# Altium project MIXR UI.PrjPcb
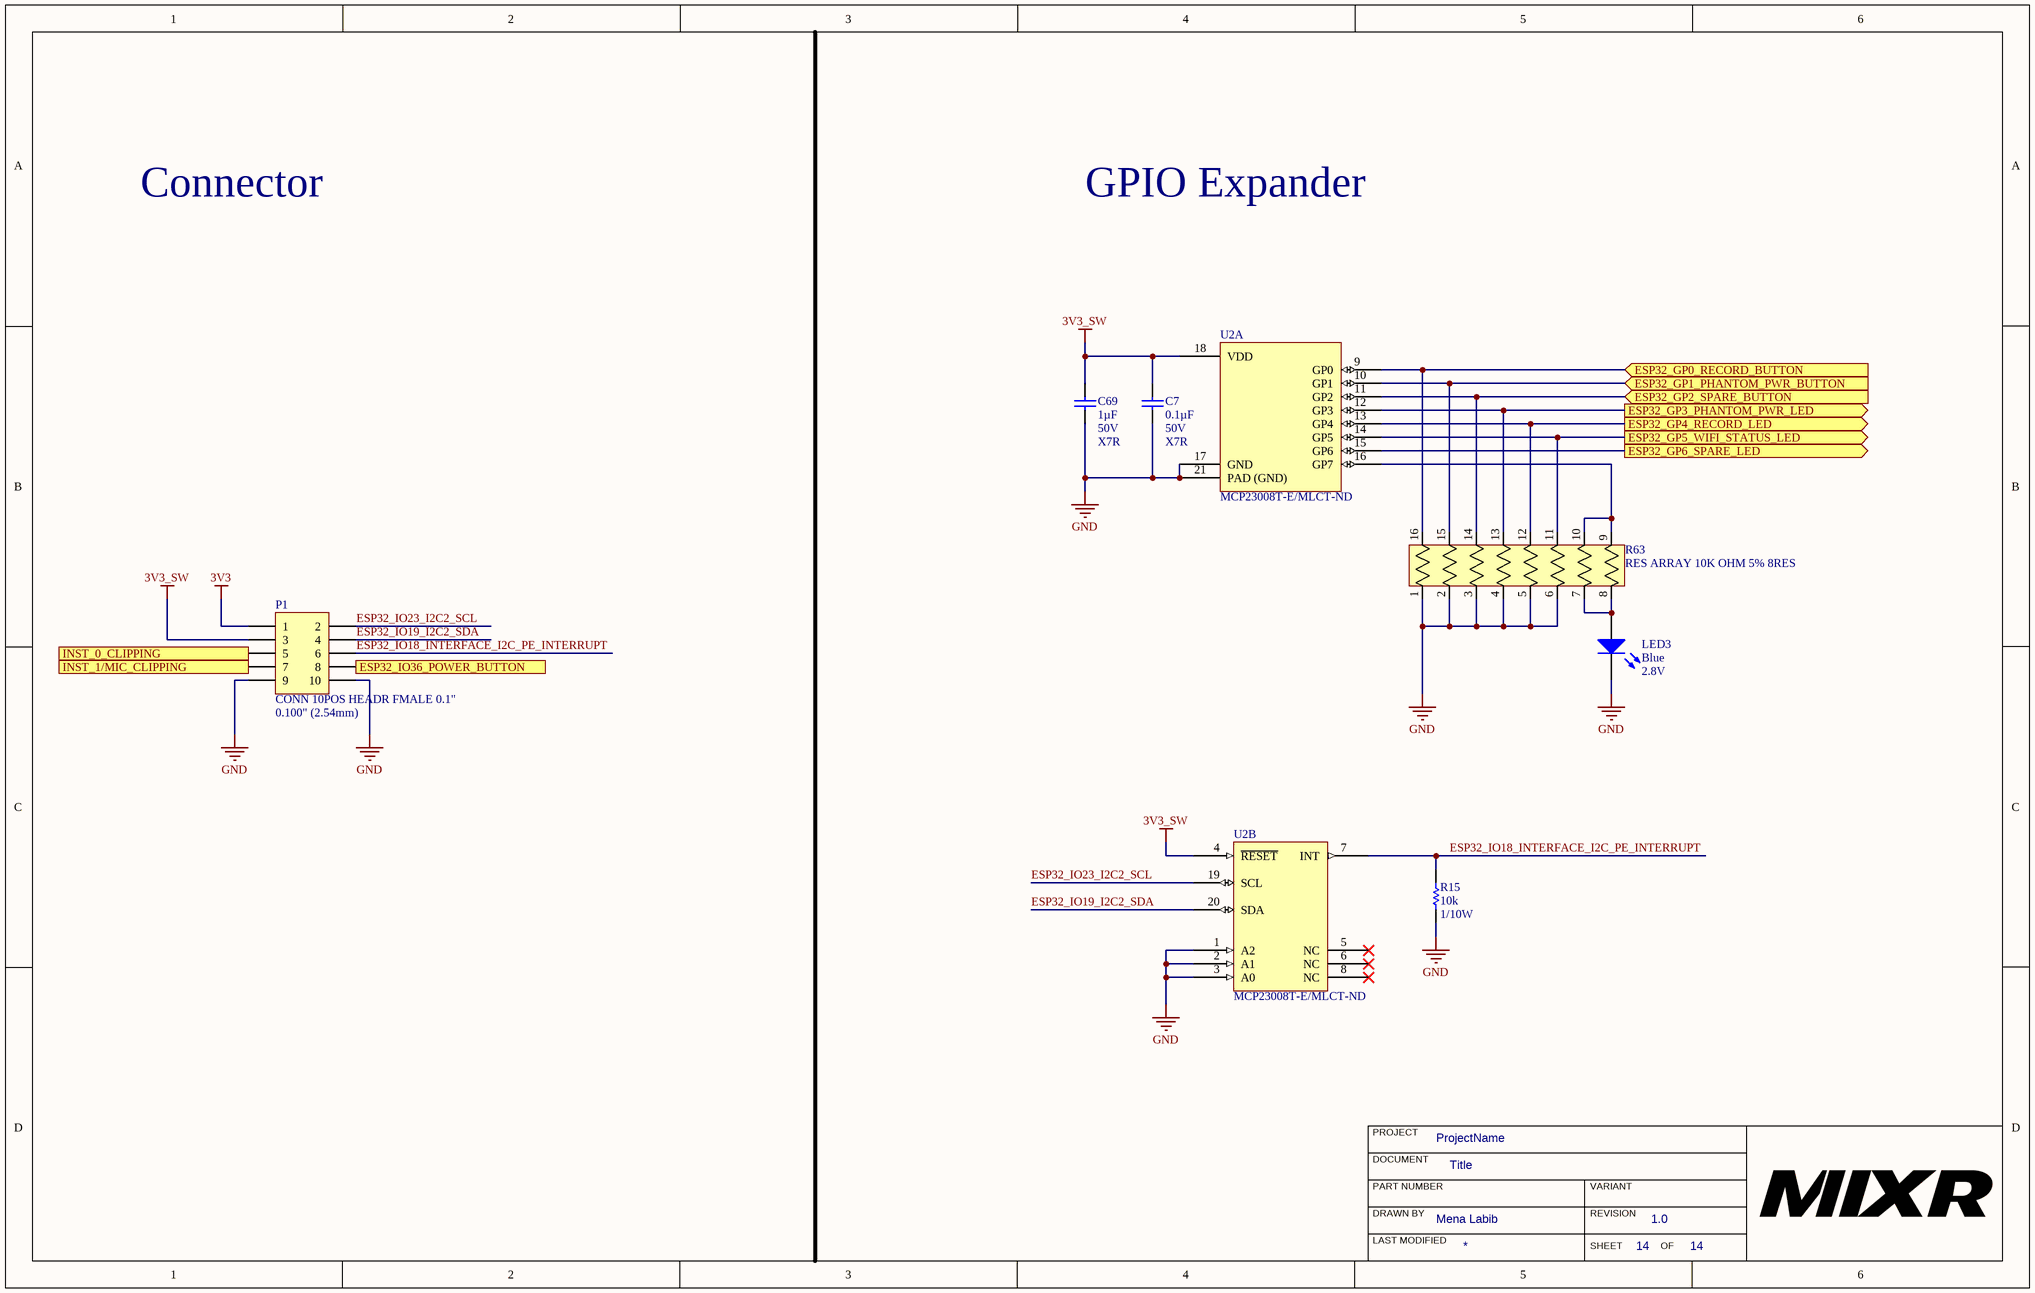
[diagram p0: MIXR UI - Buttons.SchDoc]
ProjectAuthor: Mena Labib; ProjectRevision: 1.0
2 sheets, 38 parts. Net scope: flat (ports and power ports of the same name join across sheets).
Board file: MIXR UI.PcbDoc
Sheets:
  MIXR UI - Buttons.SchDoc
  MIXR UI.SchDoc

## Sheet MIXR UI - Buttons.SchDoc: Title
size B; Organization: Midnight Sun Solar Rayce Car Team; Address1: University of Waterloo; Address2: 200 University Ave W; Address3: Waterloo, ON, Canada; Address4: N2L 3E9; DocumentNumber: 14; SheetNumber: 14; SheetTotal: 14; Website: www.uwmidsun.com; ProjectName: ProjectName

### Parts
C7  Capacitance: 0.1µF  Voltage: 50V  Temperature Coefficient: X7R  [CAP, 0603]  (hidden comment: CAP CER 0.1UF 50V 10% X7R 0603)
C69  Capacitance: 1µF  Voltage: 50V  Temperature Coefficient: X7R  [CAP, 0603]  (hidden comment: CAP CER 1UF 50V 10% X7R 0603)
LED3  Color: Blue  Voltage - Forward (Vf) (Typ): 2.8V  [LED_0603]  (hidden comment: LED BLUE CLEAR 2.8V 0603)
P1  CONN 10POS HEADR FMALE 0.1"  Pitch - Mating: 0.100" (2.54mm)  [CONN ,10 POS Header 0.100"]
R15  Resistance: 10k  Power: 1/10W  [RES, 0603]  (hidden comment: RES 10K OHM 1% 1/10W 0603)
R63  RES ARRAY 10K OHM 5% 8RES  [RES ARRAY, 8 POS 1506]
U2  Supplier Part Number 1: MCP23008T-E/MLCT-ND  [QFN50P400X400X100_HS-21M]  (hidden comment: MCP23008)  (parts A,B of 2)

### Ports
ESP32_GP0_RECORD_BUTTON (in), ESP32_GP1_PHANTOM_PWR_BUTTON (in), ESP32_GP2_SPARE_BUTTON (in), ESP32_GP3_PHANTOM_PWR_LED (out), ESP32_GP4_RECORD_LED (out), ESP32_GP5_WIFI_STATUS_LED (out), ESP32_GP6_SPARE_LED (out), ESP32_IO36_POWER_BUTTON (in), INST_0_CLIPPING (out), INST_1/MIC_CLIPPING (out)

### Nets
3V3: P1.1
3V3_SW: C7.1 C69.1 P1.3 U2.4(~{RESET}) U2.18(VDD)
GND: C7.2 C69.2 LED3.2(K) P1.9 P1.10 R15.2 R63.1 R63.2 R63.3 R63.4 R63.5 R63.6 U2.1(A2) U2.2(A1) U2.3(A0) U2.17(GND) U2.21(PAD_(GND))
ESP32_IO18_INTERFACE_I2C_PE_INTERRUPT: P1.6 R15.1 U2.7(INT)
ESP32_IO19_I2C2_SDA: P1.4 U2.20(SDA)
ESP32_IO23_I2C2_SCL: P1.2 U2.19(SCL)
NetC3_1: R63.16 U2.9(GP0) ; port ESP32_GP0_RECORD_BUTTON
NetC4_1: R63.14 U2.11(GP2) ; port ESP32_GP2_SPARE_BUTTON
NetC5_1: R63.15 U2.10(GP1) ; port ESP32_GP1_PHANTOM_PWR_BUTTON
NetC6_1: P1.8 ; port ESP32_IO36_POWER_BUTTON
NetLED3_1: LED3.1(A) R63.7 R63.8
NetP1_5: P1.5 ; port INST_0_CLIPPING
NetP1_7: P1.7 ; port INST_1/MIC_CLIPPING
NetR7_2: U2.15(GP6) ; port ESP32_GP6_SPARE_LED
NetR8_2: R63.13 U2.12(GP3) ; port ESP32_GP3_PHANTOM_PWR_LED
NetR9_2: R63.12 U2.13(GP4) ; port ESP32_GP4_RECORD_LED
NetR10_2: R63.11 U2.14(GP5) ; port ESP32_GP5_WIFI_STATUS_LED
NetR63_9: R63.9 R63.10 U2.16(GP7)

Not connected (* = marked no-connect by the designer): U2 5(NC)* 6(NC)* 8(NC)*

### Notes on the sheet
- Connector
- GPIO Expander
- PROJECT
- DOCUMENT
- DRAWN BY
- LAST MODIFIED
- PART NUMBER
- REVISION
- SHEET
- VARIANT
- OF

### Library data of the parts
C7 = CAP CER 0.1UF 50V 10% X7R 0603: 0.10µF ±10% 50V Ceramic Capacitor X7R 0603 (1608 Metric); Manufacturer 1: AVX Corporation; Manufacturer Part Number 1: 06035C104KAT2A; Supplier 1: Digi-Key; Supplier Part Number 1: 478-5052-1-ND; Packaging: Cut Tape (CT); Part Status: Active; Operating Temperature: -55°C ~ 125°C; Ratings: -; Mounting Type: Surface Mount, MLCC; Package / Case: 0603 (1608 Metric); Size / Dimension: 0.063" L x 0.032" W (1.60mm x 0.81mm); Height - Seated (Max): -; Thickness (Max): 0.035" (0.90mm); Lead Spacing: -; Lead Style: -; ComponentLink1URL: http://datasheets.avx.com/X7RDielectric.pdf; ComponentLink1Description: http://datasheets.avx.com/X7RDielectric.pdf; Tolerance: ±10%
C69 = CAP CER 1UF 50V 10% X7R 0603: 1µF ±10% 50V Ceramic Capacitor X7R 0603 (1608 Metric); Manufacturer 1: Taiyo Yuden; Manufacturer Part Number 1: UMK107AB7105KA-T; Supplier 1: Digi-Key; Supplier Part Number 1: 587-3247-1-ND; Packaging: Cut Tape (CT); Part Status: Active; Operating Temperature: -55°C ~ 125°C; Ratings: -; Mounting Type: Surface Mount, MLCC; Package / Case: 0603 (1608 Metric); Size / Dimension: 0.063" L x 0.031" W (1.60mm x 0.80mm); Height - Seated (Max): -; Thickness (Max): 0.037" (0.95mm); Lead Spacing: -; Lead Style: -; ComponentLink1URL: http://www.yuden.co.jp/productdata/catalog/en/mlcc_all_e.pdf; ComponentLink1Description: http://www.yuden.co.jp/productdata/catalog/en/mlcc_all_e.pdf; Tolerance: ±10%
LED3 = LED BLUE CLEAR 2.8V 0603: Blue 470nm LED Indication - Discrete 2.8V 0603 (1608 Metric); Manufacturer 1: Lite-On Inc.; Manufacturer Part Number 1: LTST-C193TBKT-5A; Lens Color: Colorless; Millicandela Rating: 15mcd; Lens Style/Size: Rectangle with Flat Top, 1.15mm x 0.80mm; Current - Test: 5mA; Viewing Angle: 130°; Wavelength - Peak: 468nm; Supplier 1: Digi-Key; Supplier Part Number 1: 160-1827-1-ND; Packaging: Cut Tape (CT); Part Status: Active; Lens Transparency: Clear; Mounting Type: Surface Mount; Wavelength - Dominant: 470nm; Package / Case: 0603 (1608 Metric); Supplier Device Package: Chip LED; Size / Dimension: 1.60mm L x 0.80mm W; Height (Max): 0.45mm; ComponentLink1URL: http://optoelectronics.liteon.com/upload/download/DS22-2004-060/P_100_LTST-C193TBKT-5A.pdf; ComponentLink1Description: http://optoelectronics.liteon.com/upload/download/DS22-2004-060/P_100_LTST-C193TBKT-5A.pdf
P1 = CONN 10POS HEADR FMALE 0.1": 10 Position Header Connector 0.100" (2.54mm) Through Hole, Right Angle Gold; Manufacturer 1: Sullins Connector Solutions; Manufacturer Part Number 1: SFH11-PBPC-D05-RA-BK; Style: Board to Board; Number of Positions: 10; Number of Positions Loaded: All; Contact Length - Post: 0.106" (2.69mm); Material Flammability Rating: UL94 V-0; Current Rating: 3A; Supplier 1: Digi-Key; Supplier Part Number 1: S9202-ND; Packaging: Tray; Part Status: Active; Connector Type: Header; Contact Type: Female Socket; Number of Rows: 2; Row Spacing - Mating: 0.100" (2.54mm); Mounting Type: Through Hole, Right Angle; Termination: Solder; Fastening Type: Push-Pull; Contact Finish - Mating: Gold; Contact Finish Thickness - Mating: Flash; Insulation Color: Black; Insulation Height: 0.236" (6.00mm); Operating Temperature: -40°C ~ 105°C; Contact Finish - Post: Gold; Mated Stacking Heights: -; Ingress Protection: -; Insulation Material: Polybutylene Terephthalate (PBT); Contact Shape: Square; Contact Material: Brass; Contact Finish Thickness - Post: Flash; ComponentLink1URL: http://sullinscorp.com/catalogs/147_PAGE119_.100_SFH11_SERIES_FEMALE_HDR_ST_RA.pdf; ComponentLink1Description: http://sullinscorp.com/catalogs/147_PAGE119_.100_SFH11_SERIES_FEMALE_HDR_ST_RA.pdf; Voltage: -
R15 = RES 10K OHM 1% 1/10W 0603: RES SMD 10K OHM 1% 1/10W 0603; Manufacturer 1: Yageo; Manufacturer Part Number 1: RC0603FR-0710KL; Temperature Coefficient: ±100ppm/°C; Supplier 1: Digi-Key; Supplier Part Number 1: 311-10.0KHRCT-ND; Packaging: Cut Tape (CT); Part Status: Active; Composition: Thick Film; Operating Temperature: -55°C ~ 155°C; Package / Case: 0603 (1608 Metric); Supplier Device Package: 0603; Size / Dimension: 0.063" L x 0.031" W (1.60mm x 0.80mm); Height - Seated (Max): 0.022" (0.55mm); Failure Rate: -; ComponentLink1URL: http://www.yageo.com/documents/recent/PYu-RC_Group_51_RoHS_L_7.pdf; ComponentLink1Description: http://www.yageo.com/documents/recent/PYu-RC_Group_51_RoHS_L_7.pdf; Tolerance: ±1%
R63 = RES ARRAY 10K OHM 5% 8RES EXB-2HV103JV: RES ARRAY SMD 10K 5% 62.5mW 1506; Manufacturer: Panasonic Electronic Components; Vendor: Panasonic; C: Copyright (C) 2015 Accelerated Designs. All rights reserved; Circuit Type: Isolated; Temperature Coefficient: ±200ppm/°C; Value: Value; Copyright: Copyright (C) 2015 Accelerated Designs. All rights reserved; Manufacturer_Part_Number: EXB-2HV103JV; Supplier 1: Digi-Key; Manufacturer Part Number: EXB-2HV103JV; RoHS: RoHS Compliant; Category: Resistors; Stock 1: 152779; Pricing 1: 1=0.43, 10=0.373, 25=0.2712, 50=0.1964, 100=0.1456, 250=0.11176, 500=0.08806, 1000=0.06096 (CAD); Packaging: Cut Tape (CT); Part Status: Active; Resistance (Ohms): 10k; Tolerance: ±5%; Power Per Element: 62.5mW; Operating Temperature: -55°C ~ 125°C; Applications: Automotive AEC-Q200; Mounting Type: Surface Mount; Package / Case: 1506, Convex, Long Side Terminals; Supplier Device Package: 1506; Size / Dimension: 0.150" L x 0.063" W (3.80mm x 1.60mm); Height - Seated (Max): 0.022" (0.55mm); ComponentLink1URL: https://industrial.panasonic.com/cdbs/www-data/pdf/AOC0000/AOC0000C14.pdf; ComponentLink1Description: https://industrial.panasonic.com/cdbs/www-data/pdf/AOC0000/AOC0000C14.pdf; Supplier Part Number 1: Y1103CT-ND
U2 = IC I/O EXPANDER I2C 8CH 20 QFN: I/O Expander 8 I²C 1.7MHz 20-QFN-EP (4x4) /; Manufacturer 1: Microchip; Manufacturer Part Number 1: MCP23008T-E/ML; Interface: I2C,Serial; Number of I/Os: 8; Power Dissipation: 700mW; Operating Supply Voltage: 5.5V; ComponentLink1URL: http://www.microchip.com/mymicrochip/filehandler.aspx?ddocname=en021920; ComponentLink1Description: http://www.microchip.com/mymicrochip/filehandler.aspx?ddocname=en021920; Supplier 1: Digi-Key; Stock 1: 3994; Pricing 1: 1=1.10000, 25=0.92000, 100=0.84000 (USD); RoHS: Yes; Case/Package: QFN; Min Operating Temperature: -40°C; Max Operating Temperature: 125°C; Packaging: Tape and Reel; Package Quantity: 3300; Frequency: 1.7MHz; Max Frequency: 1.7MHz; Lead Free: Lead Free; ComponentLink2URL: https://datasheet.ciiva.com/16617/21919e-16617627.pdf?src-supplier=Avnet+Europe; ComponentLink2Description: https://datasheet.ciiva.com/16617/21919e-16617627.pdf?src-supplier=Avnet+Europe; ComponentLink3URL: https://datasheet.ciiva.com/12267/21919e-12267580.pdf?src-supplier=Mouser; ComponentLink3Description: https://datasheet.ciiva.com/12267/21919e-12267580.pdf?src-supplier=Mouser; ComponentLink4URL: https://datasheet.ciiva.com/8128/21919e-8128685.pdf?src-supplier=Avnet; ComponentLink4Description: https://datasheet.ciiva.com/8128/21919e-8128685.pdf?src-supplier=Avnet

## Sheet MIXR UI.SchDoc
size B
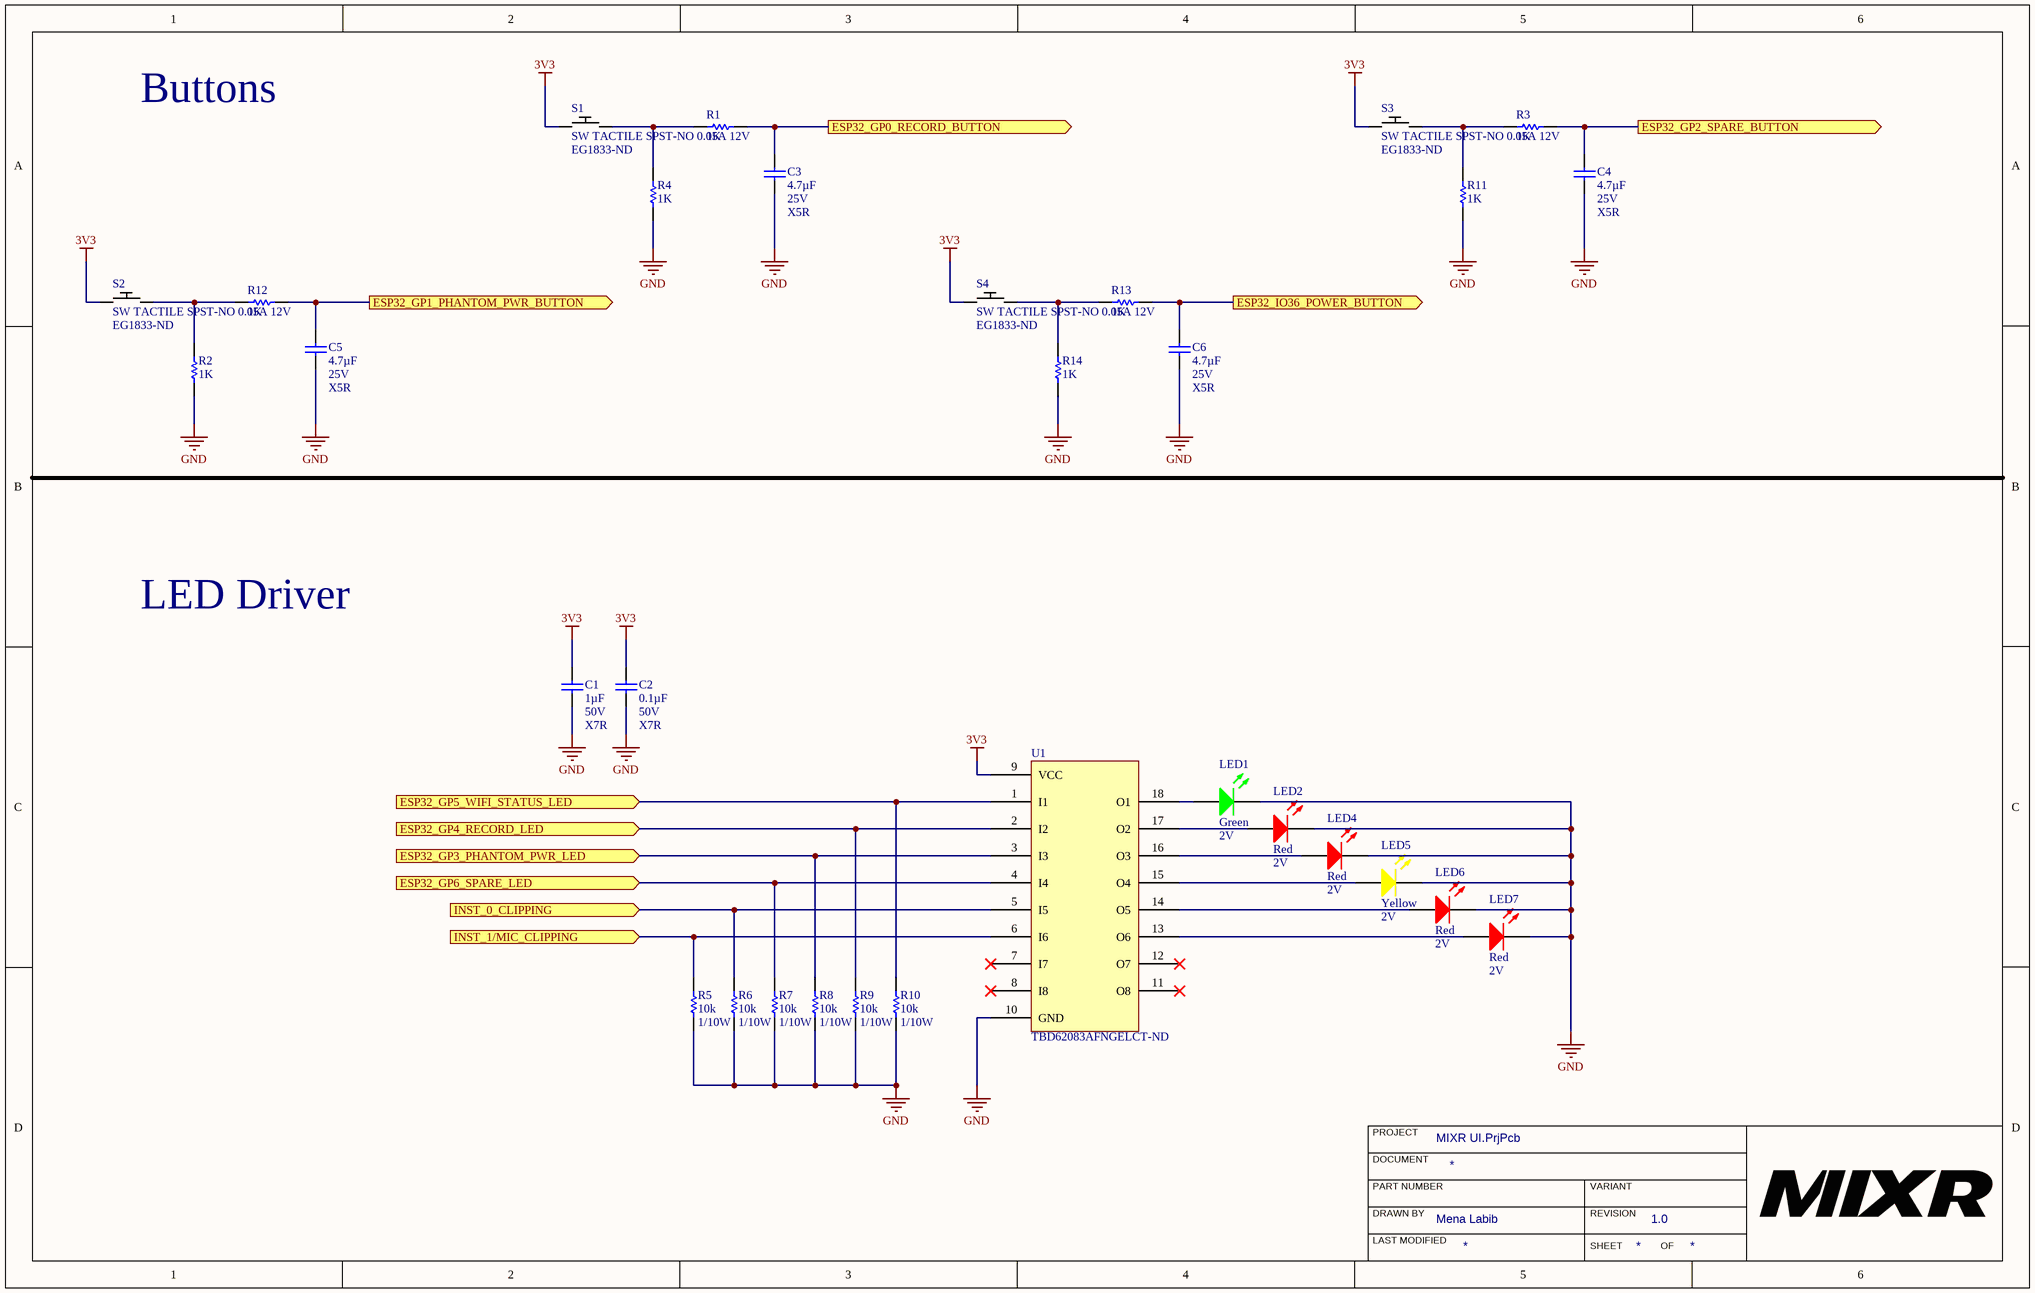
[diagram p1: MIXR UI.SchDoc]

### Parts
C1  Capacitance: 1µF  Voltage: 50V  Temperature Coefficient: X7R  [CAP, 0603]  (hidden comment: CAP CER 1UF 50V 10% X7R 0603)
C2  Capacitance: 0.1µF  Voltage: 50V  Temperature Coefficient: X7R  [CAP, 0603]  (hidden comment: CAP CER 0.1UF 50V 10% X7R 0603)
C3  Capacitance: 4.7µF  Voltage: 25V  Temperature Coefficient: X5R  [CAP, 0603]  (hidden comment: CAP CER 4.7UF 25V 10% X5R 0603)
C4  Capacitance: 4.7µF  Voltage: 25V  Temperature Coefficient: X5R  [CAP, 0603]  (hidden comment: CAP CER 4.7UF 25V 10% X5R 0603)
C5  Capacitance: 4.7µF  Voltage: 25V  Temperature Coefficient: X5R  [CAP, 0603]  (hidden comment: CAP CER 4.7UF 25V 10% X5R 0603)
C6  Capacitance: 4.7µF  Voltage: 25V  Temperature Coefficient: X5R  [CAP, 0603]  (hidden comment: CAP CER 4.7UF 25V 10% X5R 0603)
LED1  Color: Green  Voltage - Forward (Vf) (Typ): 2V  [LED_0603]  (hidden comment: LED GREEN CLEAR 2V 0603)
LED2  Color: Red  Voltage - Forward (Vf) (Typ): 2V  [LED_0603]  (hidden comment: LED RED CLEAR 2V 0603)
LED4  Color: Red  Voltage - Forward (Vf) (Typ): 2V  [LED_0603]  (hidden comment: LED RED CLEAR 2V 0603)
LED5  Color: Yellow  Voltage - Forward (Vf) (Typ): 2V  [LED_0603]  (hidden comment: LED YELLOW CLEAR 2.1V 0603)
LED6  Color: Red  Voltage - Forward (Vf) (Typ): 2V  [LED_0603]  (hidden comment: LED RED CLEAR 2V 0603)
LED7  Color: Red  Voltage - Forward (Vf) (Typ): 2V  [LED_0603]  (hidden comment: LED RED CLEAR 2V 0603)
R1  1K  [RES, 0603]
R2  1K  [RES, 0603]
R3  1K  [RES, 0603]
R4  1K  [RES, 0603]
R5  Resistance: 10k  Power: 1/10W  [RES, 0603]  (hidden comment: RES 10K OHM 1% 1/10W 0603)
R6  Resistance: 10k  Power: 1/10W  [RES, 0603]  (hidden comment: RES 10K OHM 1% 1/10W 0603)
R7  Resistance: 10k  Power: 1/10W  [RES, 0603]  (hidden comment: RES 10K OHM 1% 1/10W 0603)
R8  Resistance: 10k  Power: 1/10W  [RES, 0603]  (hidden comment: RES 10K OHM 1% 1/10W 0603)
R9  Resistance: 10k  Power: 1/10W  [RES, 0603]  (hidden comment: RES 10K OHM 1% 1/10W 0603)
R10  Resistance: 10k  Power: 1/10W  [RES, 0603]  (hidden comment: RES 10K OHM 1% 1/10W 0603)
R11  1K  [RES, 0603]
R12  1K  [RES, 0603]
R13  1K  [RES, 0603]
R14  1K  [RES, 0603]
S1  SW TACTILE SPST-NO 0.05A 12V  Supplier Part Number 1: EG1833-ND  [SW SPST-NO 6x6mm Via Hole]
S2  SW TACTILE SPST-NO 0.05A 12V  Supplier Part Number 1: EG1833-ND  [SW SPST-NO 6x6mm Via Hole]
S3  SW TACTILE SPST-NO 0.05A 12V  Supplier Part Number 1: EG1833-ND  [SW SPST-NO 6x6mm Via Hole]
S4  SW TACTILE SPST-NO 0.05A 12V  Supplier Part Number 1: EG1833-ND  [SW SPST-NO 6x6mm Via Hole]
U1  Supplier Part Number 1: TBD62083AFNGELCT-ND  [IC LOAD SWITCH 8CH 0.5A 18-SSOP]  (hidden comment: IC LOAD SWITCH 8CH 0.5A 18SSOP)

### Ports
ESP32_GP0_RECORD_BUTTON (out), ESP32_GP1_PHANTOM_PWR_BUTTON (out), ESP32_GP2_SPARE_BUTTON (out), ESP32_GP3_PHANTOM_PWR_LED (in), ESP32_GP4_RECORD_LED (in), ESP32_GP5_WIFI_STATUS_LED (in), ESP32_GP6_SPARE_LED (in), ESP32_IO36_POWER_BUTTON (out), INST_0_CLIPPING (in), INST_1/MIC_CLIPPING (in)

### Nets
3V3: C1.1 C2.1 S1.1 S2.1 S3.1 S4.1 U1.9(VCC)
GND: C1.2 C2.2 C3.2 C4.2 C5.2 C6.2 LED1.2(K) LED2.2(K) LED4.2(K) LED5.2(K) LED6.2(K) LED7.2(K) R2.2 R4.2 R5.1 R6.1 R7.1 R8.1 R9.1 R10.1 R11.2 R14.2 U1.10(GND)
NetC3_1: C3.1 R1.2 ; port ESP32_GP0_RECORD_BUTTON
NetC4_1: C4.1 R3.2 ; port ESP32_GP2_SPARE_BUTTON
NetC5_1: C5.1 R12.2 ; port ESP32_GP1_PHANTOM_PWR_BUTTON
NetC6_1: C6.1 R13.2 ; port ESP32_IO36_POWER_BUTTON
NetLED1_1: LED1.1(A) U1.18(O1)
NetLED2_1: LED2.1(A) U1.17(O2)
NetLED4_1: LED4.1(A) U1.16(O3)
NetLED5_1: LED5.1(A) U1.15(O4)
NetLED6_1: LED6.1(A) U1.14(O5)
NetLED7_1: LED7.1(A) U1.13(O6)
NetP1_5: R6.2 U1.5(I5) ; port INST_0_CLIPPING
NetP1_7: R5.2 U1.6(I6) ; port INST_1/MIC_CLIPPING
NetR1_1: R1.1 R4.1 S1.2
NetR2_1: R2.1 R12.1 S2.2
NetR3_1: R3.1 R11.1 S3.2
NetR7_2: R7.2 U1.4(I4) ; port ESP32_GP6_SPARE_LED
NetR8_2: R8.2 U1.3(I3) ; port ESP32_GP3_PHANTOM_PWR_LED
NetR9_2: R9.2 U1.2(I2) ; port ESP32_GP4_RECORD_LED
NetR10_2: R10.2 U1.1(I1) ; port ESP32_GP5_WIFI_STATUS_LED
NetR13_1: R13.1 R14.1 S4.2

Not connected (* = marked no-connect by the designer): U1 7(I7)* 8(I8)* 11(O8)* 12(O7)*

### Notes on the sheet
- Buttons
- LED Driver
- PROJECT
- DOCUMENT
- DRAWN BY
- LAST MODIFIED
- PART NUMBER
- REVISION
- SHEET
- VARIANT
- OF

### Library data of the parts
C1 = CAP CER 1UF 50V 10% X7R 0603: as C69 on sheet MIXR UI - Buttons; Supplier 1: Digi-Key; Supplier Part Number 1: 587-3247-1-ND; Packaging: Cut Tape (CT); Part Status: Active; Operating Temperature: -55°C ~ 125°C; Ratings: -; Mounting Type: Surface Mount, MLCC; Package / Case: 0603 (1608 Metric); Size / Dimension: 0.063" L x 0.031" W (1.60mm x 0.80mm); Height - Seated (Max): -; Thickness (Max): 0.037" (0.95mm); Lead Spacing: -; Lead Style: -; ComponentLink1URL: http://www.yuden.co.jp/productdata/catalog/en/mlcc_all_e.pdf; ComponentLink1Description: http://www.yuden.co.jp/productdata/catalog/en/mlcc_all_e.pdf; Tolerance: ±10%
C2 = CAP CER 0.1UF 50V 10% X7R 0603: as C7 on sheet MIXR UI - Buttons; Supplier 1: Digi-Key; Supplier Part Number 1: 478-5052-1-ND; Packaging: Cut Tape (CT); Part Status: Active; Operating Temperature: -55°C ~ 125°C; Ratings: -; Mounting Type: Surface Mount, MLCC; Package / Case: 0603 (1608 Metric); Size / Dimension: 0.063" L x 0.032" W (1.60mm x 0.81mm); Height - Seated (Max): -; Thickness (Max): 0.035" (0.90mm); Lead Spacing: -; Lead Style: -; ComponentLink1URL: http://datasheets.avx.com/X7RDielectric.pdf; ComponentLink1Description: http://datasheets.avx.com/X7RDielectric.pdf; Tolerance: ±10%
C3-C6 = CAP CER 4.7UF 25V 10% X5R 0603: 4.7µF ±10% 25V Ceramic Capacitor X5R 0603 (1608 Metric); Manufacturer 1: Murata Electronics North America; Manufacturer Part Number 1: GRM188R61E475KE11D; Supplier 1: Digi-Key; Supplier Part Number 1: 490-7203-1-ND; Packaging: Cut Tape (CT); Part Status: Active; Operating Temperature: -55°C ~ 85°C; Ratings: -; Mounting Type: Surface Mount, MLCC; Package / Case: 0603 (1608 Metric); Size / Dimension: 0.063" L x 0.031" W (1.60mm x 0.80mm); Height - Seated (Max): -; Thickness (Max): 0.031" (0.80mm); Lead Spacing: -; Lead Style: -; ComponentLink1URL: http://www.murata.com/~/media/webrenewal/support/library/catalog/products/capacitor/mlcc/c02e.ashx; ComponentLink1Description: http://www.murata.com/~/media/webrenewal/support/library/catalog/products/capacitor/mlcc/c02e.ashx; Tolerance: ±10%
LED1 = LED GREEN CLEAR 2V 0603: Green 572nm LED Indication - Discrete 2V 0603 (1608 Metric); Manufacturer: Wurth Electronics Inc.; Manufacturer Part Number: 150060VS75000; Lens Color: Colorless; Millicandela Rating: 40mcd; Lens Style/Size: Rectangle with Flat Top, 1.10mm x 0.70mm; Current - Test: 20mA; Viewing Angle: 140°; Wavelength - Dominant: 570nm; Supplier 1: Digi-Key; RoHS: RoHS Compliant; Category: Optoelectronics; Stock 1: 9408; Pricing 1: 1=0.21, 100=0.1617, 500=0.13964 (CAD); Packaging: Cut Tape (CT); Part Status: Active; Lens Transparency: Clear; Mounting Type: Surface Mount; Wavelength - Peak: 572nm; Features: -; Package / Case: 0603 (1608 Metric); Supplier Device Package: 0603; Size / Dimension: 1.60mm L x 0.80mm W; Height (Max): 0.80mm; ComponentLink1URL: http://katalog.we-online.de/led/datasheet/150060VS75000.pdf; ComponentLink1Description: http://katalog.we-online.de/led/datasheet/150060VS75000.pdf; Supplier Part Number 1: 732-4980-1-ND
LED2 LED4 LED6 LED7 = LED RED CLEAR 2V 0603: Red 631nm LED Indication - Discrete 2V 0603 (1608 Metric); Manufacturer: Wurth Electronics Inc.; Manufacturer Part Number: 150060RS75000; Lens Color: Colorless; Millicandela Rating: 250mcd; Lens Style/Size: Rectangle with Flat Top, 1.10mm x 0.70mm; Current - Test: 20mA; Viewing Angle: 140°; Wavelength - Dominant: 625nm; Wavelength - Peak: 630nm; Supplier 1: Digi-Key; RoHS: RoHS Compliant; Category: Optoelectronics; Stock 1: 35521; Pricing 1: 1=0.21, 100=0.1617, 500=0.13964 (CAD); Packaging: Cut Tape (CT); Part Status: Active; Lens Transparency: Clear; Mounting Type: Surface Mount; Features: -; Package / Case: 0603 (1608 Metric); Supplier Device Package: 0603; Size / Dimension: 1.60mm L x 0.80mm W; Height (Max): 0.80mm; ComponentLink1URL: http://katalog.we-online.de/led/datasheet/150060RS75000.pdf; ComponentLink1Description: http://katalog.we-online.de/led/datasheet/150060RS75000.pdf; Supplier Part Number 1: 732-4978-1-ND
LED5 = LED YELLOW CLEAR 2.1V 0603: Yellow 590nm LED Indication - Discrete 2V 0603 (1608 Metric); Manufacturer: Wurth Electronics Inc.; Manufacturer Part Number: 150060YS75000; Lens Color: Colorless; Millicandela Rating: 120mcd; Lens Style/Size: Rectangle with Flat Top, 1.10mm x 0.70mm; Current - Test: 20mA; Viewing Angle: 140°; Wavelength - Peak: 595nm; Supplier 1: Digi-Key; RoHS: RoHS Compliant; Category: Optoelectronics; Stock 1: 10523; Pricing 1: 1=0.21, 100=0.1617, 500=0.13964 (CAD); Packaging: Cut Tape (CT); Part Status: Active; Lens Transparency: Clear; Mounting Type: Surface Mount; Wavelength - Dominant: 590nm; Features: -; Package / Case: 0603 (1608 Metric); Supplier Device Package: 0603; Size / Dimension: 1.60mm L x 0.80mm W; Height (Max): 0.80mm; ComponentLink1URL: http://katalog.we-online.de/led/datasheet/150060YS75000.pdf; ComponentLink1Description: http://katalog.we-online.de/led/datasheet/150060YS75000.pdf; Supplier Part Number 1: 732-4981-1-ND
R1-R4 R11-R14 = RES 1K OHM 5% 1/10W 0603: 1k Ohm ±5% 0.1W, 1/10W Chip Resistor 0603 (1608 Metric); Manufacturer: Yageo; Manufacturer Part Number: RC0603JR-071KL; Temperature Coefficient: ±100ppm/°C; Supplier 1: Digi-Key; Supplier Part Number 1: 311-1.0KGRCT-ND; RoHS: RoHS Compliant; Category: Resistors; Stock 1: 4415240; Pricing 1: 1=0.15, 10=0.017, 100=0.0071, 1000=0.0032, 2500=0.00278 (CAD); Packaging: Cut Tape (CT); Part Status: Active; Resistance (Ohms): 1k; Tolerance: ±5%; Power (Watts): 0.1W, 1/10W; Composition: Thick Film; Features: Moisture Resistant; Operating Temperature: -55°C ~ 155°C; Package / Case: 0603 (1608 Metric); Supplier Device Package: 0603; Size / Dimension: 0.063" L x 0.031" W (1.60mm x 0.80mm); Height - Seated (Max): 0.022" (0.55mm); Failure Rate: -; ComponentLink1URL: http://www.yageo.com/documents/recent/PYu-RC_Group_51_RoHS_L_7.pdf; ComponentLink1Description: http://www.yageo.com/documents/recent/PYu-RC_Group_51_RoHS_L_7.pdf
R5-R10 = RES 10K OHM 1% 1/10W 0603: as R15 on sheet MIXR UI - Buttons; Supplier 1: Digi-Key; Supplier Part Number 1: 311-10.0KHRCT-ND; Packaging: Cut Tape (CT); Part Status: Active; Composition: Thick Film; Operating Temperature: -55°C ~ 155°C; Package / Case: 0603 (1608 Metric); Supplier Device Package: 0603; Size / Dimension: 0.063" L x 0.031" W (1.60mm x 0.80mm); Height - Seated (Max): 0.022" (0.55mm); Failure Rate: -; ComponentLink1URL: http://www.yageo.com/documents/recent/PYu-RC_Group_51_RoHS_L_7.pdf; ComponentLink1Description: http://www.yageo.com/documents/recent/PYu-RC_Group_51_RoHS_L_7.pdf; Tolerance: ±1%
S1-S4 = SW TACTILE SPST-NO 0.05A 12V: Tactile Switch SPST-NO Top Actuated Through Hole; Manufacturer: E-Switch; Manufacturer Part Number: TL1105BF160Q; Mechanical Life: 100000Cycles; Actuator Material: Nylon,Polyamide; Current Rating: 50mA; Operating Force: 160gf; Max Voltage Rating (DC): 50V; Contact Resistance: 100mR; Throw Configuration: SPST; Illumination Type: Non-Illuminated,Illuminated; Switch Travel: 0.25mm; Switch Function: Off-Mom; Actuator Type: Standard; Actuator Length: 5.9mm; Supplier 1: Digi-Key; RoHS: Yes; Stock 1: 31168; Pricing 1: 1 = 0.19000, 10 = 0.18800, 25 = 0.18200, 50 = 0.17540, 100 = 0.16560, 250 = 0.15584, 500 = 0.14936, 1000 = 0.11365, 5000 = 0.09416 (USD); Mount: Through Hole; Contact Plating: Silver; Contact Material: Silver,Bronze; Housing Material: Nylon; Min Operating Temperature: -20°C; Max Operating Temperature: 70°C; Package Quantity: 750; Voltage Rating (DC): 12V; Packaging: Bulk; Termination: PC Pin; Electrical Life: 100000Cycles; Orientation: Straight; Contact Current Rating: 50mA; Voltage Rating: 12V; Insulation Resistance: 100MR; Width: 6mm; REACH SVHC: No SVHC; Lead Free: Lead Free; ComponentLink1URL: https://datasheet.ciiva.com/16156/p010003-16156249.pdf?src-supplier=Onlinecomponents.com; ComponentLink1Description: https://datasheet.ciiva.com/16156/p010003-16156249.pdf?src-supplier=Onlinecomponents.com; ComponentLink2URL: https://datasheet.ciiva.com/2900/p010003-2900804.pdf?src-supplier=Digi-Key; ComponentLink2Description: https://datasheet.ciiva.com/2900/p010003-2900804.pdf?src-supplier=Digi-Key; ComponentLink3URL: https://datasheet.ciiva.com/7637/tl1105-7637643.pdf?src-supplier=Element14; ComponentLink3Description: https://datasheet.ciiva.com/7637/tl1105-7637643.pdf?src-supplier=Element14
U1 = IC LOAD SWITCH 8CH 0.5A 18SSOP: IC LOAD SWITCH 8CHANNEL 0.5A 18SSOP; Manufacturer: Toshiba; Manufacturer Part Number: TBD62083AFNG,EL; Number of Outputs: 8; Interface: On/Off; Output Configuration: Low Side; ComponentLink1URL: http://www.mouser.com/ds/2/408/TBD62783APG_datasheet_en_20160511-775715.pdf?src-supplier=Mouser; ComponentLink1Description: http://www.mouser.com/ds/2/408/TBD62783APG_datasheet_en_20160511-775715.pdf?src-supplier=Mouser; ComponentLink2URL: https://toshiba.semicon-storage.com/info/docget.jsp?did=30523&prodName=TBD62783AFG&src-supplier=Digi-Key; ComponentLink2Description: https://toshiba.semicon-storage.com/info/docget.jsp?did=30523&prodName=TBD62783AFG&src-supplier=Digi-Key; ComponentLink3URL: http://www.toshiba.semicon-storage.com/info/docget.jsp?did=14247&src-supplier=Digi-Key; ComponentLink3Description: http://www.toshiba.semicon-storage.com/info/docget.jsp?did=14247&src-supplier=Digi-Key; Supplier 1: Digi-Key; RoHS: Yes; Stock 1: 61183; Pricing 1: 1 = 0.78000, 10 = 0.68500, 25 = 0.60680, 100 = 0.52840, 250 = 0.45988, 500 = 0.39140, 1000 = 0.31312 (USD); Case/Package: LSSOP; Number of Pins: 18; Min Operating Temperature: -40°C; Max Operating Temperature: 85°C; Packaging: Tape and Reel; ComponentLink4URL: https://toshiba.semicon-storage.com/info/docget.jsp?did=29893&prodName=TBD62083AFG&src-supplier=Digi-Key; ComponentLink4Description: https://toshiba.semicon-storage.com/info/docget.jsp?did=29893&prodName=TBD62083AFG&src-supplier=Digi-Key

## Nets that join several sheets
3V3: MIXR UI - Buttons (P1.1), MIXR UI (7 pins)
GND: MIXR UI - Buttons (17 pins), MIXR UI (23 pins)
NetC3_1: MIXR UI - Buttons (R63.16 U2.9), MIXR UI (C3.1 R1.2)
NetC4_1: MIXR UI - Buttons (R63.14 U2.11), MIXR UI (C4.1 R3.2)
NetC5_1: MIXR UI - Buttons (R63.15 U2.10), MIXR UI (C5.1 R12.2)
NetC6_1: MIXR UI - Buttons (P1.8), MIXR UI (C6.1 R13.2)
NetP1_5: MIXR UI - Buttons (P1.5), MIXR UI (R6.2 U1.5)
NetP1_7: MIXR UI - Buttons (P1.7), MIXR UI (R5.2 U1.6)
NetR7_2: MIXR UI - Buttons (U2.15), MIXR UI (R7.2 U1.4)
NetR8_2: MIXR UI - Buttons (R63.13 U2.12), MIXR UI (R8.2 U1.3)
NetR9_2: MIXR UI - Buttons (R63.12 U2.13), MIXR UI (R9.2 U1.2)
NetR10_2: MIXR UI - Buttons (R63.11 U2.14), MIXR UI (R10.2 U1.1)